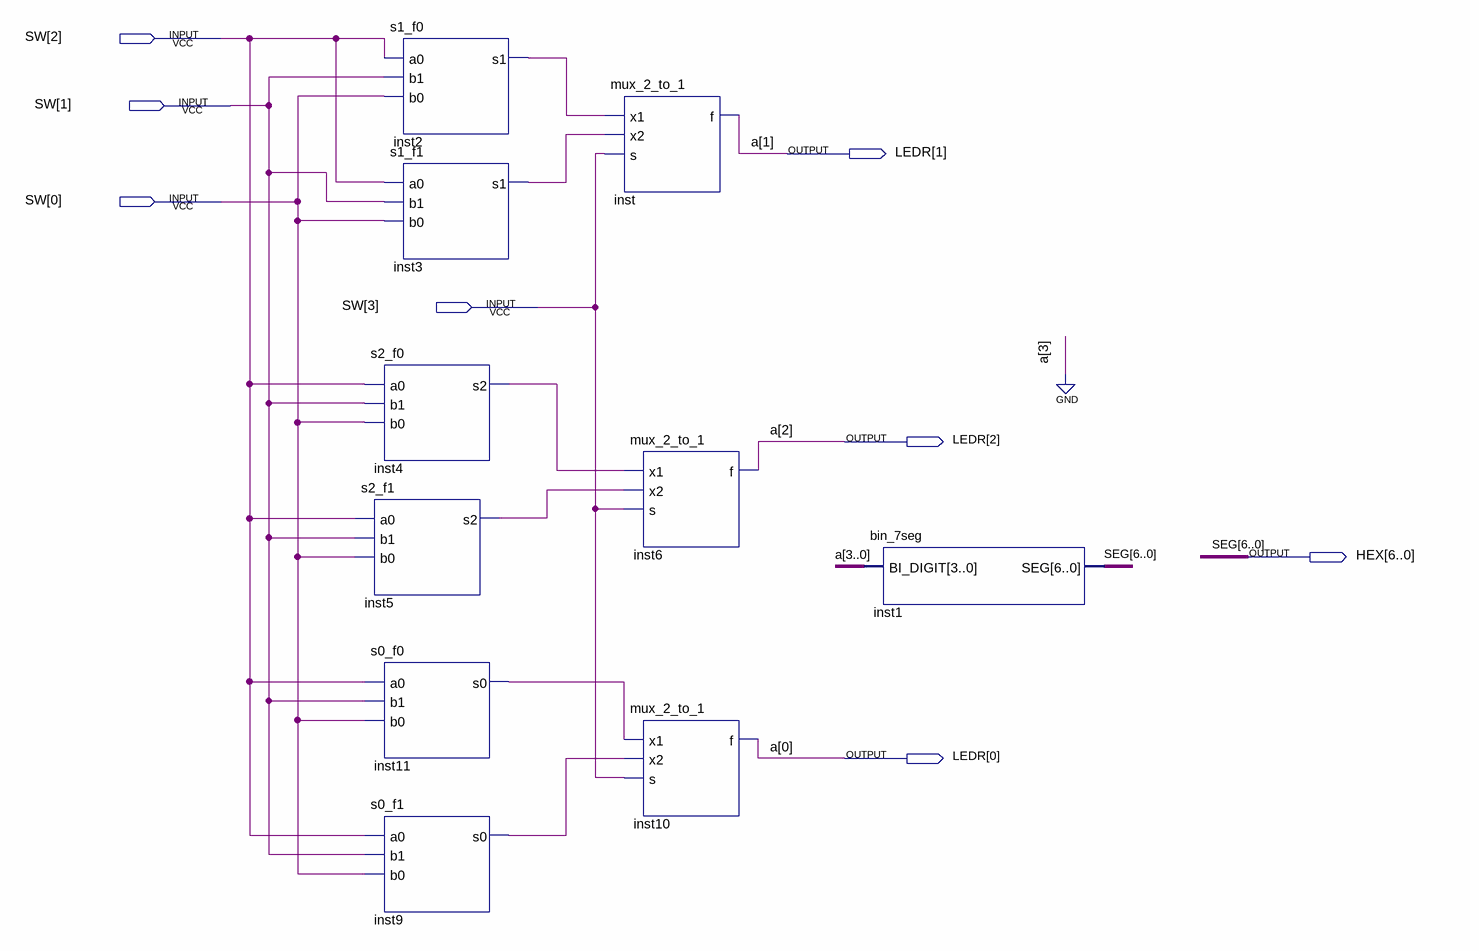
[diagram p0: schematic sheet]
// Quartus schematic Lab4.bdf as structural Verilog: 10 symbols, 8 pins
module Lab4 (
  input  [3:0] SW,
  output [2:0] LEDR,
  output [6:0] HEX
);

  wire inst2_s1, inst3_s1, inst4_s2, inst5_s2, inst9_s0, inst11_s0;

  s1_f0 inst2 (.a0(SW[2]), .b1(SW[1]), .b0(SW[0]), .s1(inst2_s1));
  s1_f1 inst3 (.a0(SW[2]), .b1(SW[1]), .b0(SW[0]), .s1(inst3_s1));
  s2_f0 inst4 (.a0(SW[2]), .b1(SW[1]), .b0(SW[0]), .s2(inst4_s2));
  s2_f1 inst5 (.a0(SW[2]), .b1(SW[1]), .b0(SW[0]), .s2(inst5_s2));
  s0_f0 inst11 (.a0(SW[2]), .b1(SW[1]), .b0(SW[0]), .s0(inst11_s0));
  s0_f1 inst9 (.a0(SW[2]), .b1(SW[1]), .b0(SW[0]), .s0(inst9_s0));
  mux_2_to_1 inst (.x1(inst2_s1), .x2(inst3_s1), .s(SW[3]), .f(LEDR[1]));
  mux_2_to_1 inst6 (.x1(inst4_s2), .x2(inst5_s2), .s(SW[3]), .f(LEDR[2]));
  mux_2_to_1 inst10 (.x1(inst11_s0), .x2(inst9_s0), .s(SW[3]), .f(LEDR[0]));
  bin_7seg inst1 (.BI_DIGIT({1'b0, LEDR}), .SEG(HEX));

  // Other names for the same wires on the sheet: a[2:0] = LEDR; SEG[6:0] = HEX
endmodule
